# Altium schematic sheet SQUID_Channel.SchDoc: Analog chain
size Letter; DrawnBy: J.-F. Cliche & Adam Gilbert; Engineer: J.-F. Cliche; DocumentNumber: 2; Revision: Rev2; SheetNumber: 2; SheetTotal: 5; ProjectTitle: DAN Squid Controller
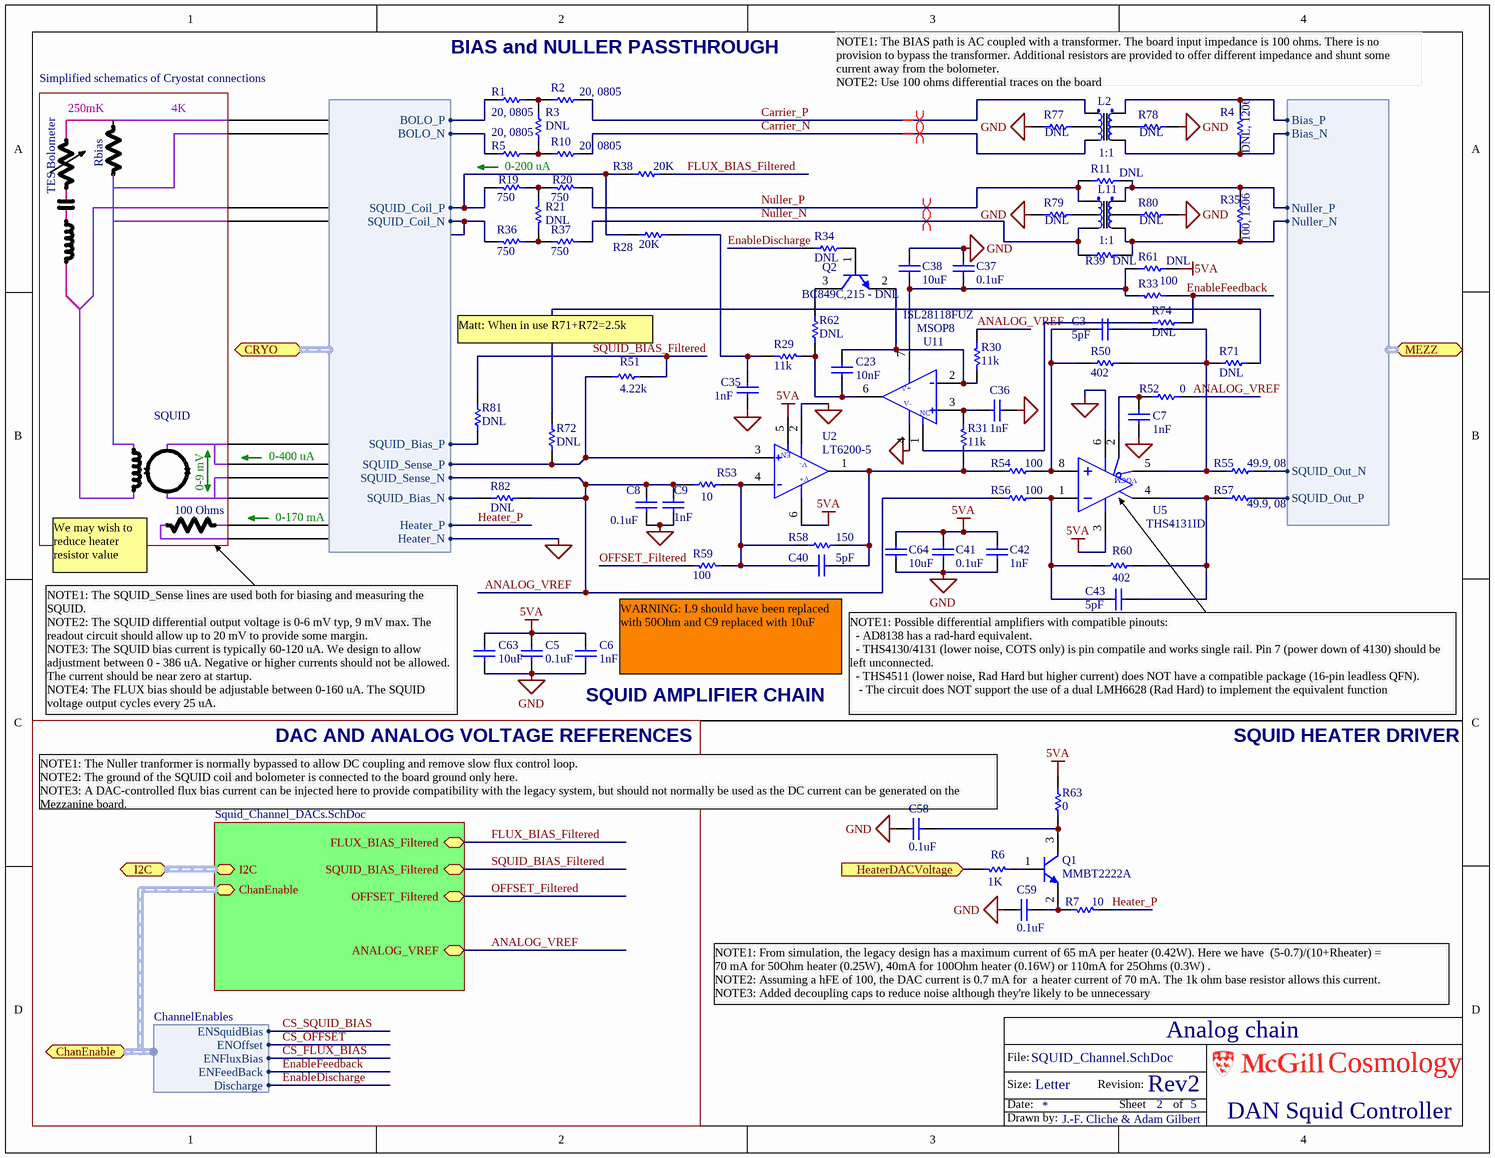
[diagram p0: SQUID_Channel.SchDoc]

## Parts
C3  5pF  [0603]
C5  0.1uF  [0603]
C6  1nF  [0603]
C7  1nF  [0603]
C8  0.1uF  [0603]
C9  1nF  [0603]
C23  10nF  [0603]
C35  1nF  [0603]
C36  1nF  [0603]
C37  0.1uF  [0603]
C38  value 10uF  [CC3225-1210]  (hidden comment: 10uF, 1210)
C40  5pF  [0603]
C41  0.1uF  [0603]
C42  1nF  [0603]
C43  5pF  [0603]
C58  0.1uF  [0603]
C59  0.1uF  [0603]
C63  value 10uF  [CC3225-1210]  (hidden comment: 10uF, 1210)
C64  value 10uF  [CC3225-1210]  (hidden comment: 10uF, 1210)
L2  Transformer  [TTWB]  (value not drawn)
L11  Transformer  [TTWB]  (value not drawn)
Q1  MMBT2222A  [SOT23]
Q2  BC849C,215 - DNL  [SOT23]
R1  20, 0805  [0805]
R2  20, 0805  [0805]
R3  DNL  [0805]
R4  DNL, 1206  [1206]
R5  20, 0805  [0805]
R6  1k  [0603]
R7  10  [0603]
R10  20, 0805  [0805]
R11  DNL  [0603]
R19  750  [0603]
R20  750  [0603]
R21  DNL  [0603]
R28  20k  [0603]
R29  11k  [0603]
R30  11k  [0603]
R31  11k  [0603]
R33  100  [0603]
R34  DNL  [0603]
R35  100, 1206  [1206]
R36  750  [0603]
R37  750  [0603]
R38  20k  [0603]
R39  DNL  [0603]
R48  0  [0603]
R50  402  [0603]
R51  4.22k  [0603]
R52  0  [0603]
R53  10  [0603]
R54  100  [0603]
R55  49.9, 0805  [0805]
R56  100  [0603]
R57  49.9, 0805  [0805]
R58  150  [0603]
R59  100  [0603]
R60  402  [0603]
R61  DNL  [0603]
R62  DNL  [0603]
R63  0  [0603]
R71  DNL  [0603]
R72  DNL  [0603]
R74  DNL  [0603]
R77  DNL  [0603]
R78  DNL  [0603]
R79  DNL  [0603]
R80  DNL  [0603]
R81  DNL  [0603]
R82  DNL  [0603]
U2  LT6200-5  [SOT23-6]
U5  THS4131ID  [SO8]
U11  ISL28118FUZ  [MSOP8-P82B96]

## Sub-sheets
REFS = Squid_Channel_DACs.SchDoc: FLUX_BIAS_Filtered, SQUID_BIAS_Filtered, OFFSET_Filtered, ANALOG_VREF, ChanEnable (harness ChannelEnables), I2C (harness I2C)

## Ports
ChanEnable (harness ChannelEnables), CRYO (harness SQUID_CH_IN), HeaterDACVoltage (in), I2C (harness I2C), MEZZ (harness SQUID_CH_OUT)

## Harnesses
SQUID_CH_IN: SQUID_Coil_P, SQUID_Coil_N, BOLO_P, BOLO_N, SQUID_Bias_P, SQUID_Sense_P, SQUID_Sense_N, Heater_P, SQUID_Bias_N, Heater_N
SQUID_CH_OUT: Bias_P, Bias_N, Nuller_P, Nuller_N, SQUID_Out_P, SQUID_Out_N
ChannelEnables: ENSquidBias, ENOffset, ENFluxBias, ENFeedBack, Discharge

## Nets
5VA: C5.2 C6.2 C41.2 C42.2 C63.2 C64.2 R61.2 R63.1 U2.5(En) U2.6(V+) U5.3(V+)
GND: C5.1 C6.1 C7.1 C8.1 C9.1 C35.2 C36.1 C37.1 C38.1 C41.1 C42.1 C58.2 C59.2 C63.1 C64.1 R48.2 R77.1 R78.2 R79.1 R80.2 U2.2(V-) U5.6(V-) U11.4(V-) ; port CRYO.Heater_N
ANALOG_VREF: C8.2 C9.2 R30.1 R52.1 R53.2 R56.2 R82.2 ; sheet REFS/ANALOG_VREF, port CRYO.SQUID_Sense_N
Carrier_N: L2.3(Prim) R10.1
Carrier_P: L2.1(PrimDot) R2.1
CS_FLUX_BIAS: port ChanEnable.ENFluxBias
CS_OFFSET: port ChanEnable.ENOffset
CS_SQUID_BIAS: port ChanEnable.ENSquidBias
EnableDischarge: R34.1 ; port ChanEnable.Discharge
EnableFeedback: R33.2 R74.1 ; port ChanEnable.ENFeedBack
FLUX_BIAS_Filtered: R38.1 ; sheet REFS/FLUX_BIAS_Filtered
Heater_P: R7.1 ; port CRYO.Heater_P
HeaterDACVoltage: R6.2 ; port HeaterDACVoltage
Nuller_N: L11.3(Prim) R37.2 R39.1
Nuller_P: L11.1(PrimDot) R11.1 R20.2
OFFSET_Filtered: R59.1 ; sheet REFS/OFFSET_Filtered
SQUID_BIAS_Filtered: R51.1 R81.1 ; sheet REFS/SQUID_BIAS_Filtered
NetC3_1: C3.1 R50.1 R55.1 R71.1 U5.5(OUT-)
NetC3_2: C3.2 R50.2 R54.1 U5.8(IN+)
NetC7_2: C7.2 R52.2 U5.2(VOCM)
NetC23_1: C23.1 Q2.2(E) R30.2 U11.2(IN-)
NetC23_2: C23.2 R29.2 R62.1 U11.6(OUT-)
NetC35_1: C35.1 R28.2 R29.1
NetC36_2: C36.2 R31.2 U11.3(IN+)
NetC37_2: C37.2 C38.2 R33.1 R61.1 U11.7(V+)
NetC40_1: C40.1 R31.1 R54.2 R58.1 U2.1(OUT)
NetC40_2: C40.2 R53.1 R58.2 R59.2 U2.4(IN-)
NetC43_1: C43.1 R57.1 R60.1 U5.4(OUT+)
NetC43_2: C43.2 R56.1 R60.2 U5.1(IN-)
NetC58_1: C58.1 Q1.3(C) R63.2
NetC59_1: C59.1 Q1.2(E) R7.2
NetL2_2: L2.2(PrimCent) R77.2
NetL2_4: L2.4(Sec) R4.2 ; port MEZZ.Bias_N
NetL2_5: L2.5(SecCent) R78.1
NetL2_6: L2.6(SecDot) R4.1 ; port MEZZ.Bias_P
NetL11_2: L11.2(PrimCent) R79.2
NetL11_4: L11.4(Sec) R35.2 R39.2 ; port MEZZ.Nuller_N
NetL11_5: L11.5(SecCent) R80.1
NetL11_6: L11.6(SecDot) R11.2 R35.1 ; port MEZZ.Nuller_P
NetQ1_1: Q1.1(B) R6.1
NetQ2_1: Q2.1(B) R34.2
NetQ2_3: Q2.3(C) R62.2
NetR1_1: R1.1 ; port CRYO.BOLO_P
NetR1_2: R1.2 R2.2 R3.1
NetR3_2: R3.2 R5.2 R10.2
NetR5_1: R5.1 ; port CRYO.BOLO_N
NetR19_1: R19.1 R20.1 R21.1
NetR19_2: R19.2 R28.1 R38.2 ; port CRYO.SQUID_Coil_P
NetR21_2: R21.2 R36.1 R37.1
NetR36_2: R36.2 R48.1 ; port CRYO.SQUID_Coil_N
NetR51_2: R51.2 R72.2 U2.3(IN+) ; port CRYO.SQUID_Sense_P
NetR55_2: R55.2 ; port MEZZ.SQUID_Out_N
NetR57_2: R57.2 ; port MEZZ.SQUID_Out_P
NetR71_2: R71.2 R72.1
NetR74_2: R74.2 U11.1(SHDN)
NetR81_2: R81.2 ; port CRYO.SQUID_Bias_P
NetR82_1: R82.1 ; port CRYO.SQUID_Bias_N

Not connected (* = marked no-connect by the designer): U5 7(NC)

## Buses and harness runs
harness port ChanEnable = sheet REFS/ChanEnable
harness port I2C = sheet REFS/I2C

## Layout directives
differential pair: Carrier_N, Carrier_P, Nuller_N, Nuller_P

## Notes on the sheet
- Simplified schematics of Cryostat connections
- BIAS and NULLER PASSTHROUGH
- NOTE1: The BIAS path is AC coupled with a transformer. The board input impedance is 100 ohms. There is no provision to bypass the transformer. Additional resistors are provided to offer different impedance and shunt some current away from the bolometer.
  NOTE2: Use 100 ohms differential traces on the board
- 250mK
- Rbias
- 4K
- (near L2) 1:1
- TES Bolometer
- 0-200 uA
- 1:1
- (near R51) Matt: When in use R71+R72=2.5k
- MSOP8
- SQUID
- 0-9 mV
- 0-400 uA
- We may wish to reduce heater resistor value
- 100 Ohms
- 0-170 mA
- (near C6) SQUID AMPLIFIER CHAIN
- WARNING: L9 should have been replaced with 50Ohm and C9 replaced with 10uF
- (near C63) NOTE1: The SQUID_Sense lines are used both for biasing and measuring the SQUID.
  NOTE2: The SQUID differential output voltage is 0-6 mV typ, 9 mV max. The readout circuit should allow up to 20 mV to provide some margin.
  NOTE3: The SQUID bias current is typically 60-120 uA. We design to allow adjustment between 0 - 386 uA. Negative or higher currents should not be allowed. The current should be near zero at startup.
  NOTE4: The FLUX bias should be adjustable between 0-160 uA. The SQUID voltage output cycles every 25 uA.
- DAC AND ANALOG VOLTAGE REFERENCES
- (near C43) NOTE1: Possible differential amplifiers with compatible pinouts:
  - AD8138 has a rad-hard equivalent.
  - THS4130/4131 (lower noise, COTS only) is pin compatile and works single rail. Pin 7 (power down of 4130) should be left unconnected.
  - THS4511 (lower noise, Rad Hard but higher current) does NOT have a compatible package (16-pin leadless QFN).
  - The circuit does NOT support the use of a dual LMH6628 (Rad Hard) to implement the equivalent function
- SQUID HEATER DRIVER
- (near C58) NOTE1: The Nuller tranformer is normally bypassed to allow DC coupling and remove slow flux control loop.
  NOTE2: The ground of the SQUID coil and bolometer is connected to the board ground only here.
  NOTE3: A DAC-controlled flux bias current can be injected here to provide compatibility with the legacy system, but should not normally be used as the DC current can be generated on the Mezzanine board.
- NOTE1: From simulation, the legacy design has a maximum current of 65 mA per heater (0.42W). Here we have  (5-0.7)/(10+Rheater) =
  70 mA for 50Ohm heater (0.25W), 40mA for 100Ohm heater (0.16W) or 110mA for 25Ohms (0.3W) .
  NOTE2: Assuming a hFE of 100, the DAC current is 0.7 mA for  a heater current of 70 mA. The 1k ohm base resistor allows this current.
  NOTE3: Added decoupling caps to reduce noise although they're likely to be unnecessary
- File:
- Size:
- Date:
- Letter
- Revision:
- Sheet
- of
- Cosmology
- Drawn by:
- (in symbol LT6200-5) EN

## Library data of the parts
C3 C40 C43 = Cap0603: Capacitor, Ceramic, 0603; Part Constraints: 5pF 50V +-0.25pF COG/NPO 0603; Manufacturer: Generic; Value: 5pF; Supplier 1: Digi-Key; Supplier Part Number 1: 490-1390-1-ND
C5 C8 C37 C41 C58 C59 = Cap0603: Capacitor, Ceramic, 0603; Part Constraints: 0.1uF 16V 10% X7R; Manufacturer: Generic; Supplier 1: Digi-Key; Supplier Part Number 1: 399-1096-1-ND; Value: 0.1uF
C6 C7 C9 C35 C36 C42 = Cap0603: Capacitor, Ceramic, 0603; Part Constraints: 1nF 50V 10% X7R 0603; Manufacturer: Generic; Value: 1nF; Supplier 1: Digi-Key; Supplier Part Number 1: 399-1082-1-ND
C23 = Cap0603: Capacitor, Ceramic, 0603; Part Constraints: 10nF 16V 10% X7R 0603; Manufacturer: Generic; Manufacturer 1: TDK Corporation; Manufacturer Part Number 1: C1608X7R1H103K080AA; Description 1: CAP CER 10000PF 50V 10% X7R 0603; Category 1: Capacitors; Capacitance: 10000pF; Voltage - Rated: 50V; Tolerance: ±10%; Temperature Coefficient: X7R; Value: 10nF; Supplier 1: Digi-Key; Supplier Part Number 1: 445-1311-1-ND; RoHS 1: RoHS Compliant; Stock 1: 400596; Pricing 1: 1=0.11, 10=0.027, 100=0.0122, 250=0.01, 500=0.00854, 1000=0.00666 (CAD); Mounting Type: Surface Mount, MLCC; Operating Temperature: -55°C ~ 125°C; Applications: General Purpose; Ratings: -; Package / Case: 0603 (1608 Metric); Size / Dimension: 0.063" L x 0.031" W (1.60mm x 0.80mm); Height - Seated (Max): -; Thickness (Max): 0.037" (0.95mm); Lead Spacing: -; Features: -; Packaging: Cut Tape (CT); Lead Style: -; ComponentLink1URL: http://product.tdk.com/capacitor/mlcc/en/documents/mlcc_commercial_general_en.pdf; ComponentLink1Description: http://product.tdk.com/capacitor/mlcc/en/documents/mlcc_commercial_general_en.pdf
C38 C63 C64 = CAP 1210: Capacitor, Ceramic, 1210; Manufacturer Part Number: 1206YD106KAT2A; Manufacturer: AVX Corporation; Part Constraints: 10uF 1210 16V X5R <=1.78mm height; Voltage: 16V; Footprint: 1210; Supplier 1: Digikey; Supplier Part Number 1: 478-1573-1-ND
L2 L11 = Transformer: Manufacturer: Coilcraft; Part Constraints: TTWB2010LD; Supplier 1: Coilcraft; Supplier Part Number 1: TTWB2010LD
Q1 = 2N2222: TRANS NPN 40V 350MW SMD SOT23-3; Manufacturer: Diodes Inc; Part Constraints: MMBT2222A-FDICT-ND; Supplier 1: Digi-Key; Supplier Part Number 1: MMBT2222A-FDICT-ND
Q2 = BC849_850: TRANSISTOR NPN 30V 100MA SOT23; Manufacturer 1: NXP Semiconductors; Category 1: Discrete Semiconductor Products; Vce Saturation (Max) @ Ib, Ic: 600mV @ 5mA, 100mA; DC Current Gain (hFE) (Min) @ Ic, Vce: 420 @ 2mA, 5V; Power - Max: 250mW; Frequency - Transition: 100MHz; Supplier 1: Digi-Key; Manufacturer Part Number 1: BC849C,215; RoHS 1: RoHS Compliant; Description 1: TRANSISTOR NPN 30V 100MA SOT23; Stock 1: 9000; Pricing 1: 3000=0.04162, 6000=0.03754, 15000=0.03264, 30000=0.02938, 75000=0.02611, 150000=0.0217 (CAD); Transistor Type: NPN; Current - Collector (Ic) (Max): 100mA; Voltage - Collector Emitter Breakdown (Max): 30V; Current - Collector Cutoff (Max): -; Mounting Type: Surface Mount; Package / Case: TO-236-3, SC-59, SOT-23-3; Supplier Device Package: TO-236AB; Packaging: Tape & Reel (TR); ComponentLink1URL: http://www.nxp.com/documents/data_sheet/BC849_BC850.pdf; ComponentLink1Description: http://www.nxp.com/documents/data_sheet/BC849_BC850.pdf; Supplier Part Number 1: 568-6073-2-ND; Value: DNL
R1 R2 R5 R10 = RES 0805: RES 0805 SMD; Manufacturer: Generic; Value: 20; Part constraints: 20, 0805; Supplier 1: Digi-Key; Supplier Part Number 1: P20.0CCT-ND
R3 = RES 0805: RES 0805 SMD; Manufacturer: Generic; Value: DNL; Part constraints: DNL, 0805
R4 = RES 1206: RES 100 OHM 1/4W 1206 SMD; Manufacturer: Rohm Semiconductor; Value: DNL; Manufacturers Part Number: DNL; Part constraints: DNL; Supplier 1: Digi-Key; Supplier Part Number 1: RHM100AFCT-ND
R6 = RES 0603: Manufacturer: Generic; Manufacturer Part Number 1: e.g CRCW0603 series; Part constraints: 1K 1/10W 1% 100ppm/C 0603; Value: 1K; Supplier 1: Digi-Key; Supplier Part Number 1: 541-1.00KHTR-ND
R7 = RES 0603: Manufacturer: Generic; Part constraints: RES 10.0 OHM 1/10W 1% 0603 SMD; Manufacturer Part Number 1: e.g CRCW0603 series; Value: 10; Supplier 1: Digi-Key; Supplier Part Number 1: 541-10.0HCT-ND
R11 R21 R34 R39 R61 R62 R71 R72 R74 R81 R82 = Res0603: RES 0603; Manufacturer: Generic; Manufacturer Part Number 1: e.g CRCW0603 series; Value: DNL; Part constraints: DNL
  R21: Supplier 1: Digi-Key; Supplier Part Number 1: 541-750HCT-ND
R19 R20 R36 R37 = Res0603: RES 0603; Manufacturer: Generic; Manufacturer Part Number 1: e.g CRCW0603 series; Part constraints: 750 1/10W 1% 100ppm/C 0603; Value: 750; Supplier 1: Digi-Key; Supplier Part Number 1: 541-750HCT-ND
R28 R38 = Res0603: RES 0603; Manufacturer: Generic; Part constraints: 20K 1/10W 1% 100ppm/C 0603; Manufacturer Part Number 1: e.g CRCW0603 series; Value: 20K; Supplier 1: Digi-Key; Supplier Part Number 1: 541-20.0KHCT-ND
R29-R31 = Res0603: RES 0603; Manufacturer: Generic; Part Constraints: RES 11.0K OHM 1/10W 1% 0603 SMD; Manufacturer Part Number 1: e.g CRCW0603 series; Value: 11k; Supplier 1: Digi-Key; Supplier Part Number 1: 541-11.0KHCT-ND
R33 R54 R56 R59 = Res0603: RES 0603; Manufacturer: Generic; Part constraints: RES 100 OHM 1/10W 1% 0603 SMD; Manufacturer Part Number 1: e.g CRCW0603 series; Value: 100; Supplier 1: Digi-Key; Supplier Part Number 1: 541-100HCT-ND
R35 = RES 1206: RES 100 OHM 1/4W 1206 SMD; Manufacturers Part Number: ESR18EZPF1000; Manufacturer: Rohm Semiconductor; Part constraints: 100 Ohm, 1206, 100ppm, 1%, 1/3W; Value: 100; Supplier 1: Digi-Key; Supplier Part Number 1: RHM100AFCT-ND
R48 R52 R63 R77-R80 = Res0603: RES 0603; Manufacturer: Generic; Part constraints: 0 1/10W 1% 100ppm/C 0603; Manufacturer Part Number 1: e.g CRCW0603 series; Supplier 1: Digi-Key; Supplier Part Number 1: 541-0.0GCT-ND
  R48 R52 R63: Value: 0
  R77-R80: Value: DNL
R50 = RES 0603: Manufacturer: Generic; Part constraints: 402 1/10W 1% 100ppm/C 0603; Manufacturer Part Number 1: e.g CRCW0603 series; Value: 402; Supplier 1: Digi-Key; Supplier Part Number 1: 541-402HCT-ND
R51 = Res0603: RES 0603; Manufacturer: Generic; Part constraints: 4.22K 1/10W 1% 100ppm/C 0603; Manufacturer Part Number 1: e.g CRCW0603 series; Value: 4.22k; Supplier 1: Digi-Key; Supplier Part Number 1: 541-4.22KHCT-ND
R53 = Res0603: RES 0603; Manufacturer: Generic; Part constraints: RES 10.0 OHM 1/10W 1% 0603 SMD; Manufacturer Part Number 1: e.g CRCW0603 series; Value: 10; Supplier 1: Digi-Key; Supplier Part Number 1: 541-10.0HCT-ND
R55 R57 = RES 0805: RES 0805 SMD; Manufacturer: Generic; Part constraints: 49.9, 0805, 100ppm, 1%; Value: 49.9; Supplier 1: Digi-Key; Supplier Part Number 1: 541-49.9TCT-ND
R58 = Res0603: RES 0603; Part Constraints: 150 OHM 1/10W 1% 0603; Manufacturer: Generic; Manufacturer Part Number 1: e.g CRCW0603 series; Value: 150; Supplier 1: Digi-Key; Supplier Part Number 1: 541-150HCT-ND
R60 = Res0603: RES 0603; Manufacturer: Generic; Part constraints: 402 1/10W 1% 100ppm/C 0603; Manufacturer Part Number 1: e.g CRCW0603 series; Value: 402; Supplier 1: Digi-Key; Supplier Part Number 1: 541-402HCT-ND
U2 = LT6200-5: IC OPAMP R-R I/O 800MHZ SOT-23-6; Manufacturer 1: Linear Technology; Manufacturer Part Number 1: LT6200CS6-5#TRM; Category 1: Integrated Circuits (ICs); Amplifier Type: Buffer; Number of Circuits: 1; Output Type: Rail-to-Rail; Slew Rate: 250 V/µs; Current - Input Bias: 23µA; Voltage - Input Offset: 2.5mV; Current - Supply: 20mA; Current - Output / Channel: 90mA; Voltage - Supply, Single/Dual (±): 2.5 V ~ 12.6 V, ±1.25 V ~ 6.3 V; Supplier 1: Digi-Key; RoHS 1: RoHS non-compliant; Description 1: IC OPAMP R-R I/O 800MHZ SOT-23-6; Stock 1: 368; Pricing 1: 1=3.69, 25=3.3136, 100=2.9455 (CAD); Gain Bandwidth Product: 800MHz; -3db Bandwidth: -; Operating Temperature: 0°C ~ 70°C; Mounting Type: Surface Mount; Package / Case: SOT-23-6; Supplier Device Package: TSOT-23-6; Packaging: Cut Tape (CT); ComponentLink1URL: http://www.linear.com/docs/3869; ComponentLink1Description: http://www.linear.com/docs/3869; Supplier Part Number 1: LT6200CS6-5#TRMCT-ND
U5 = THS4131CD: IC AMP DIFF LDIST LP 85MA 8SOIC; Manufacturer: Texas Instruments; Amplifier Type: Differential; Number of Circuits: 1; Slew Rate: 52 V/µs; Gain Bandwidth Product: 225MHz; -3db Bandwidth: 150MHz; Current - Input Bias: 2µA; Voltage - Input Offset: 200µV; Current - Supply: 12.3mA; Voltage - Supply, Single/Dual (±): 4 V ~ 33 V, ±2 V ~ 16.5 V; Supplier 1: Digi-Key; Supplier Part Number 1: 296-10046-5-ND; Manufacturer Part Number: THS4131ID; RoHS: RoHS Compliant; Category: Integrated Circuits (ICs); Stock 1: 4172; Pricing 1: 1=8.49, 25=6.9644, 100=4.5861, 250=4.50116, 500=4.41622, 750=4.33131, 1000=4.24637 (CAD); Output Type: Differential; Current - Output / Channel: 85mA; Operating Temperature: -40°C ~ 85°C; Mounting Type: Surface Mount; Package / Case: 8-SOIC (0.154", 3.90mm Width); Supplier Device Package: 8-SOIC; Packaging: Tube; ComponentLink1URL: http://www.ti.com/lit/ds/symlink/ths4131.pdf; ComponentLink1Description: http://www.ti.com/lit/ds/symlink/ths4131.pdf
U11 = ISL28118FUZ: IC OPAMP PREC R-R 4MHZ LP 8MSOP; Manufacturer 1: Intersil; Manufacturer Part Number 1: ISL28118FUZ-T7A; Category 1: Integrated Circuits (ICs); Amplifier Type: General Purpose; Number of Circuits: 1; Output Type: Rail-to-Rail; Slew Rate: 1.2 V/µs; Current - Input Bias: 230nA; Voltage - Input Offset: 25µV; Current - Supply: 850µA; Current - Output / Channel: 28mA; Voltage - Supply, Single/Dual (±): 3 V ~ 40 V, -1.2 V/+1.8 V ~ ±20 V; Supplier 1: Digi-Key; RoHS 1: RoHS Compliant; Description 1: IC OPAMP PREC R-R 4MHZ LP 8MSOP; Stock 1: 469; Pricing 1: 1=4.51, 25=3.5524, 100=3.0141 (CAD); Gain Bandwidth Product: 4MHz; -3db Bandwidth: -; Operating Temperature: -40°C ~ 125°C; Mounting Type: Surface Mount; Package / Case: 8-TSSOP, 8-MSOP (0.118", 3.00mm Width); Supplier Device Package: 8-MSOP; Packaging: Cut Tape (CT); ComponentLink1URL: http://www.intersil.com/content/dam/Intersil/documents/fn75/fn7532.pdf; ComponentLink1Description: http://www.intersil.com/content/dam/Intersil/documents/fn75/fn7532.pdf; Supplier Part Number 1: ISL28118FUZ-T7ACT-ND